# Altium project X-CTRL Pro M12.PrjPcb
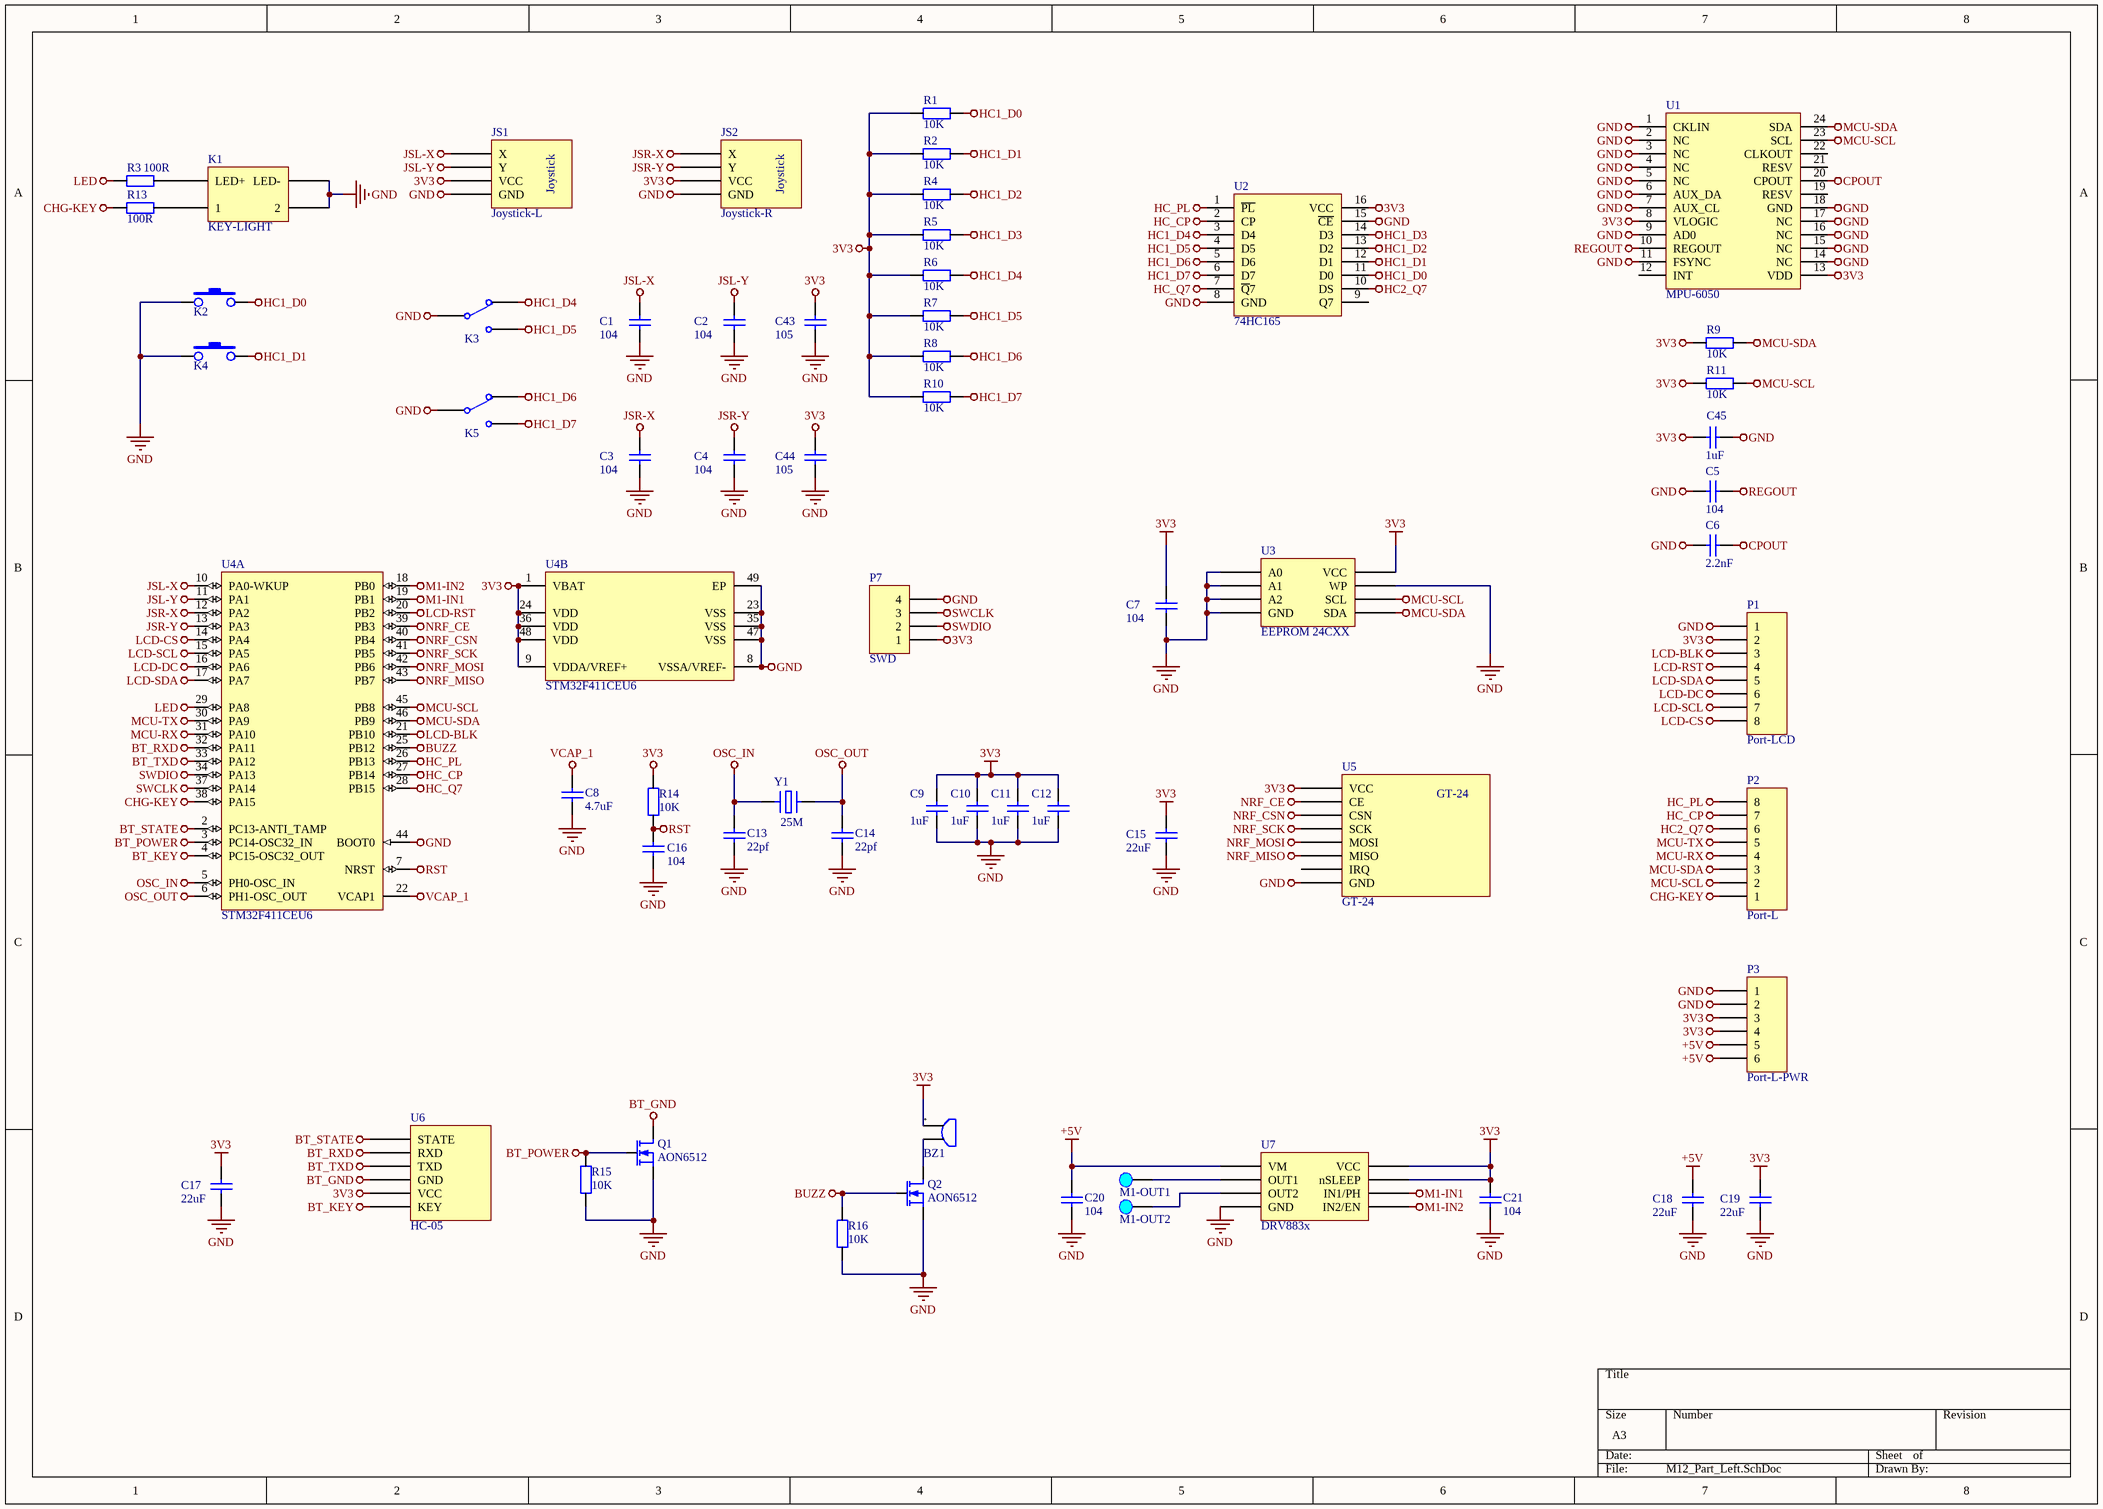
[diagram p0: M12_Part_Left.SchDoc]
2 sheets, 119 parts. Net scope: global (net labels, ports and power ports of the same name join across sheets).
Board file: M12_PCB.PcbDoc
Sheets:
  M12_Part_Left.SchDoc
  M12_Part_Right.SchDoc

## Sheet M12_Part_Left.SchDoc
size A3

### Parts
BZ1  蜂鸣器  [BUZ-SMD_4P-L7.5-W7.5-P7.59-BR]  (value not drawn)
C1  104  [电容_C0603]
C2  104  [电容_C0603]
C3  104  [电容_C0603]
C4  104  [电容_C0603]
C5  104  [电容_C0603]
C6  2.2nF  [电容_C0603]
C7  104  [电容_C0603]
C8  4.7uF  [电容_C0603]
C9  1uF  [电容_C0603]
C10  1uF  [电容_C0603]
C11  1uF  [电容_C0603]
C12  1uF  [电容_C0603]
C13  22pf  [电容_C0603]
C14  22pf  [电容_C0603]
C15  22uF  [电容_C1206]
C16  104  [电容_C0603]
C17  22uF  [电容_C1206]
C18  22uF  [电容_C1206]
C19  22uF  [电容_C1206]
C20  104  [电容_C0603]
C21  104  [电容_C0603]
C43  105  [电容_C0603]
C44  105  [电容_C0603]
C45  1uF  [电容_C0603]
JS1  Joystick-L  [ZH1.5-LS-4P]
JS2  Joystick-R  [ZH1.5-LS-4P]
K1  KEY-LIGHT  [SW-TH_4P-L12.0-W12.0-P5.00-LS12.5]
K2  SKRP  [KEY-SMD_4P-L6.0-W6.0-P3.90-LS10.0]  (value not drawn)
K3  *  [ZH1.5-WS-3P]  (value not drawn)
K4  SKRP  [KEY-SMD_4P-L6.0-W6.0-P3.90-LS10.0]  (value not drawn)
K5  *  [ZH1.5-WS-3P]  (value not drawn)
M1  M1-OUT1  [Pad_B]
M2  M1-OUT2  [Pad_B]
P1  Port-LCD  [ZH1.5-LS-8P]
P2  Port-L  [ZH1.5-WS-8P]
P3  Port-L-PWR  [ZH1.5-WS-6P]
P7  SWD  [HDR1X4]
Q1  AON6512  [MOS_SOT-23]
Q2  AON6512  [MOS_SOT-23]
R1  10K  [电阻_R0603]
R2  10K  [电阻_R0603]
R3  100R  [电阻_R0603]
R4  10K  [电阻_R0603]
R5  10K  [电阻_R0603]
R6  10K  [电阻_R0603]
R7  10K  [电阻_R0603]
R8  10K  [电阻_R0603]
R9  10K  [电阻_R0603]
R10  10K  [电阻_R0603]
R11  10K  [电阻_R0603]
R13  100R  [电阻_R0603]
R14  10K  [电阻_R0603]
R15  10K  [电阻_R0603]
R16  10K  [电阻_R0603]
U1  MPU-6050  [陀螺仪_QFN24]
U2  74HC165  [74HC系列_SOP16]
U3  EEPROM 24CXX  [SOP8]
U4  STM32F411CEU6  [STM-UFQFPN48_N]  (parts A,B of 2)
U5  GT-24  [GT-24]
U6  HC-05  [HDR1X6]
U7  DRV883x  [WSON-8_L2.0-W2.0-P0.50-TL-EP]
Y1  F: 25M  [晶振_3225]  (hidden comment: XTAL)

### Nets
3V3: BZ1.1 C7.2 C9.2 C10.2 C11.2 C12.2 C15.2 C17.2 C19.2 C21.2 C43.2 C44.2 C45.2 JS1.2(VCC) JS2.2(VCC) P1.2 P3.3 P3.4 P7.1 R1.1 R2.1 R4.1 R5.1 R6.1 R7.1 R8.1 R9.2 R10.1 R11.2 R14.2 U1.8(VLOGIC) U1.13(VDD) U2.16(VCC) U3.8(VCC) U4.1(VBAT) U4.9(VDDA/VREF+) U4.24(VDD) U4.36(VDD) U4.48(VDD) U5.1(VCC) U6.2(VCC) U7.7(nSLEEP) U7.8(VCC)
+5V: C18.2 C20.1 P3.5 P3.6 U7.1(VM)
BT_GND: Q1.2(D) U6.3(GND)
BT_KEY: U4.4(PC15-OSC32_OUT) U6.1(KEY)
BT_POWER: Q1.1(G) R15.2 U4.3(PC14-OSC32_IN)
BT_RXD: U4.32(PA11) U6.5(RXD)
BT_STATE: U4.2(PC13-ANTI_TAMP) U6.6(STATE)
BT_TXD: U4.33(PA12) U6.4(TXD)
BUZZ: Q2.1(G) R16.2 U4.25(PB12)
CHG-KEY: P2.1 R13.1 U4.38(PA15)
CPOUT: C6.1 U1.20(CPOUT)
GND: C1.1 C2.1 C3.1 C4.1 C5.2 C6.2 C7.1 C8.1 C9.1 C10.1 C11.1 C12.1 C13.2 C14.2 C15.1 C16.1 C17.1 C18.1 C19.1 C20.2 C21.1 C43.1 C44.1 C45.1 JS1.1(GND) JS2.1(GND) K1.2 K1.4(LED-) K2.1 K3.1 K4.1 K5.1 P1.1 P3.1 P3.2 P7.4 Q1.3(S) Q2.3(S) R15.1 R16.1 U1.1(CKLIN) U1.2(NC) U1.3(NC) U1.4(NC) U1.5(NC) U1.6(AUX_DA) U1.7(AUX_CL) U1.9(AD0) U1.11(FSYNC) U1.14(NC) U1.15(NC) U1.16(NC) U1.17(NC) U1.18(GND) U2.8(GND) U2.15(~{CE}) U3.1(A0) U3.2(A1) U3.3(A2) U3.4(GND) U3.7(WP) U4.8(VSSA/VREF-) U4.23(VSS) U4.35(VSS) U4.44(BOOT0) U4.47(VSS) U4.49(EP) U5.8(GND) U7.4(GND)
HC1_D0: K2.2 R1.2 U2.11(D0)
HC1_D1: K4.2 R2.2 U2.12(D1)
HC1_D2: R4.2 U2.13(D2)
HC1_D3: R5.2 U2.14(D3)
HC1_D4: K3.2 R6.2 U2.3(D4)
HC1_D5: K3.3 R7.2 U2.4(D5)
HC1_D6: K5.2 R8.2 U2.5(D6)
HC1_D7: K5.3 R10.2 U2.6(D7)
HC2_Q7: P2.6 U2.10(DS)
HC_CP: P2.7 U2.2(CP) U4.27(PB14)
HC_PL: P2.8 U2.1(~{PL}) U4.26(PB13)
HC_Q7: U2.7(~{Q}7) U4.28(PB15)
JSL-X: C1.2 JS1.4(X) U4.10(PA0-WKUP)
JSL-Y: C2.2 JS1.3(Y) U4.11(PA1)
JSR-X: C3.2 JS2.4(X) U4.12(PA2)
JSR-Y: C4.2 JS2.3(Y) U4.13(PA3)
LCD-BLK: P1.3 U4.21(PB10)
LCD-CS: P1.8 U4.14(PA4)
LCD-DC: P1.6 U4.16(PA6)
LCD-RST: P1.4 U4.20(PB2)
LCD-SCL: P1.7 U4.15(PA5)
LCD-SDA: P1.5 U4.17(PA7)
LED: R3.1 U4.29(PA8)
M1-IN1: U4.19(PB1) U7.6(IN1/PH)
M1-IN2: U4.18(PB0) U7.5(IN2/EN)
MCU-RX: P2.4 U4.31(PA10)
MCU-SCL: P2.2 R11.1 U1.23(SCL) U3.6(SCL) U4.45(PB8)
MCU-SDA: P2.3 R9.1 U1.24(SDA) U3.5(SDA) U4.46(PB9)
MCU-TX: P2.5 U4.30(PA9)
NRF_CE: U4.39(PB3) U5.2(CE)
NRF_CSN: U4.40(PB4) U5.3(CSN)
NRF_MISO: U4.43(PB7) U5.6(MISO)
NRF_MOSI: U4.42(PB6) U5.5(MOSI)
NRF_SCK: U4.41(PB5) U5.4(SCK)
OSC_IN: C13.1 U4.5(PH0-OSC_IN) Y1.1
OSC_OUT: C14.1 U4.6(PH1-OSC_OUT) Y1.2
REGOUT: C5.1 U1.10(REGOUT)
RST: C16.2 R14.1 U4.7(NRST)
SWCLK: P7.3 U4.37(PA14)
SWDIO: P7.2 U4.34(PA13)
VCAP_1: C8.2 U4.22(VCAP1)
NetBZ1_2: BZ1.2 Q2.2(D)
NetK1_1: K1.1 R13.2
NetK1_3: K1.3(LED+) R3.2
NetM1_1: M1.1 U7.2(OUT1)
NetM2_1: M2.1 U7.3(OUT2)

Not connected (* = marked no-connect by the designer): U1 0 12(INT) 19(RESV) 21(RESV) 22(CLKOUT); U2 9(Q7); U5 7(IRQ)

### Notes on the sheet
- (in symbol BZ) +

### Library data of the parts
BZ1 = BZ
C1-C21 C43-C45 = cap: U: 50V; 参数: Cap,0805,X7R,104K,50V,125C,±10%
  C1-C5 C7 C16 C20 C21: C: 104
  C6: C: 2.2nF
  C8: C: 4.7uF
  C9-C12 C45: C: 1uF
  C13 C14: C: 22pf
  C15 C17-C19: C: 22uF
  C43 C44: C: 105
JS1 JS2 = Joystick
K2 K4 = SW-PB: _Comma: ,; _Name: KEY; _Specification: KEY,SKRP,*; _Footprint: *; _Model: SKRP
K3 K5 = KEY-3: pin to pad: 1>2 2>1; _Comma: ,; _Footprint: KEY-3*6; _Name: Switch; _Specification: Switch,*,KEY-3*6; _Model: *
M1 = Pad: _Funcyusa: Test; _Specification: Pad,Test,M1-OUT1; _Comma: ,; _Name: Pad; _Remarks: M1-OUT1
M2 = Pad: _Funcyusa: Test; _Specification: Pad,Test,M1-OUT2; _Comma: ,; _Name: Pad; _Remarks: M1-OUT2
P1 P2 = Header 8: Header, 8-Pin; LatestRevisionDate: 17-Jul-2002; LatestRevisionNote: Re-released for DXP Platform.; Publisher: Altium Limited
P3 = Header 6: Header, 6-Pin; LatestRevisionDate: 17-Jul-2002; LatestRevisionNote: Re-released for DXP Platform.; Publisher: Altium Limited
P7 = Header 4: Header, 4-Pin; LatestRevisionDate: 17-Jul-2002; LatestRevisionNote: Re-released for DXP Platform.; Publisher: Altium Limited
Q1 Q2 = MOSFET-N: 参数: N-MOSFET,DFN5*6,AON6512,30V,150A
R1-R11 R13-R16 = Res: P: 1/8W; 参数: Res,0805,0R,±1%,1/8W,100ppm,155C
  R1 R2 R4-R11 R14-R16: R: 10K
  R3 R13: R: 100R
U3 = EEPROM 24CXX: 24CXX
U4 = STM32F401CCU6: ARM Cortex-M4 32-bit MCU+FPU, 105 DMIPS, 256 kB Flash, 64 kB Internal RAM, 36 I/Os, 48-pin UFQFPN, -40 to 85 degC, Tray; Manufacturer: STMicroelectronics; FLASH Size (Prog) (kB): 256; I/Os (High Current): 36; Internal RAM Size (kB): 64; Operating Frequency(F) (Processor speed) (MHz): 84; Supply Voltage(Vcc) max (V): 3.6; Supply Voltage(Vcc) min (V): 1.8; DatasheetVersion: Rev. 1; PackageVersion: Rev. 1, 04/2013; PackageReference: UFQFPN48; PackageDescription: 48-Pin Ultra Thin Fine Pitch Quad Flat No-Lead, 7 x 7 x 0.6 mm Body, 0.5 mm Pitch, Exposed Pad; Supplier 1: Newark; Supplier Part Number 1: 19X6217; Supplier 2: Mouser; Supplier Part Number 2: 511-STM32F401CCU6; Core: ARM Cortex-M4; Packing: Tray; Mounting Technology: Surface Mount; PartNumber: STM32F401CCU6; ComponentLink1Description: Manufacturer URL; ComponentLink1URL: http://www.st.com/web/en/home.html; ComponentLink2Description: Datasheet; ComponentLink2URL: http://www.st.com/st-web-ui/static/active/en/resource/technical/document/data_brief/DM00071938.pdf; ComponentLink3Description: Package Specification; ComponentLink3URL: http://www.st.com/st-web-ui/static/active/en/resource/technical/document/data_brief/DM00071938.pdf
U5 = GT-24: NRF24L01
U6 = HC-05: Bluetooth

## Sheet M12_Part_Right.SchDoc
size A3
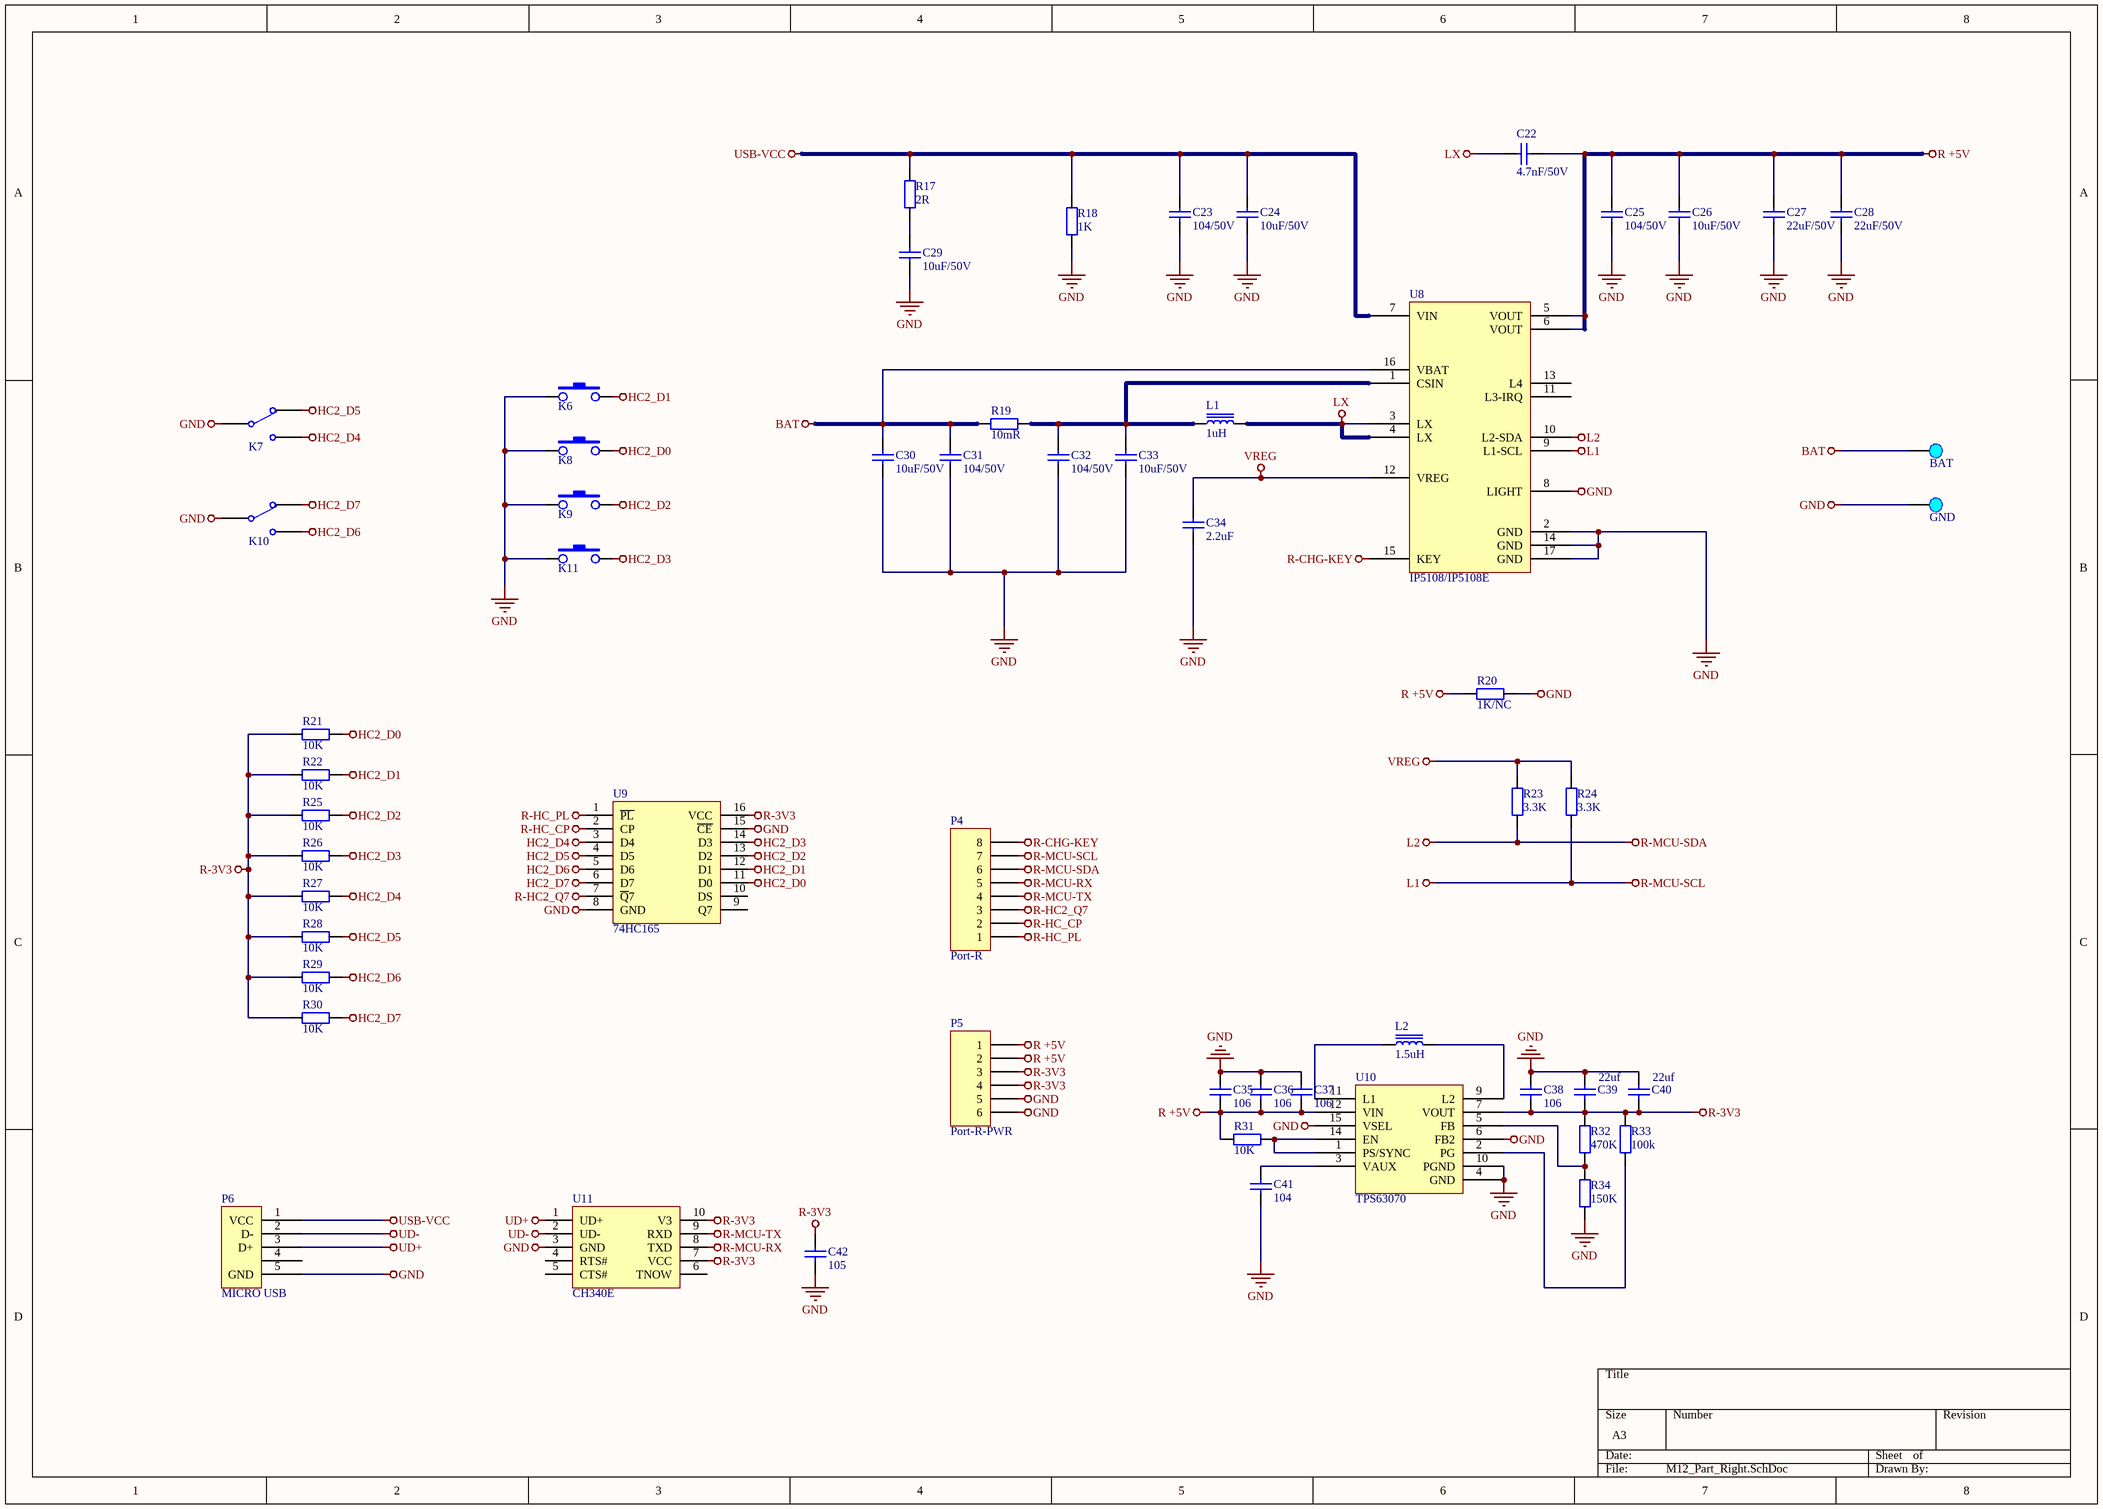
[diagram p1: M12_Part_Right.SchDoc]

### Parts
C22  _Parameter: 4.7nF/50V  [电容_C0603]  (hidden comment: 4.7nF)
C23  _Parameter: 104/50V  [电容_C0603]  (hidden comment: 104)
C24  _Parameter: 10uF/50V  [电容_C0603]  (hidden comment: 10uF)
C25  _Parameter: 104/50V  [电容_C0603]  (hidden comment: 104)
C26  _Parameter: 10uF/50V  [电容_C0603]  (hidden comment: 10uF)
C27  _Parameter: 22uF/50V  [电容_C1206]  (hidden comment: 22uF)
C28  _Parameter: 22uF/50V  [电容_C1206]  (hidden comment: 22uF)
C29  _Parameter: 10uF/50V  [电容_C0603]  (hidden comment: 10uF)
C30  _Parameter: 10uF/50V  [电容_C0603]  (hidden comment: 10uF)
C31  _Parameter: 104/50V  [电容_C0603]  (hidden comment: 104)
C32  _Parameter: 104/50V  [电容_C0603]  (hidden comment: 104)
C33  _Parameter: 10uF/50V  [电容_C0603]  (hidden comment: 10uF)
C34  _Parameter: 2.2uF  [电容_C0603]  (hidden comment: 104)
C35  106  [电容_C0603]
C36  106  [电容_C0603]
C37  106  [电容_C0603]
C38  106  [电容_C0603]
C39  22uf  [电容_C1206]
C40  22uf  [电容_C1206]
C41  104  [电容_C0603]
C42  105  [电容_C0603]
K6  SKRP  [KEY-SMD_4P-L6.0-W6.0-P3.90-LS10.0]  (value not drawn)
K7  *  [ZH1.5-WS-3P]  (value not drawn)
K8  SKRP  [KEY-SMD_4P-L6.0-W6.0-P3.90-LS10.0]  (value not drawn)
K9  SKRP  [KEY-SMD_4P-L6.0-W6.0-P3.90-LS10.0]  (value not drawn)
K10  *  [ZH1.5-WS-3P]  (value not drawn)
K11  SKRP  [KEY-SMD_4P-L6.0-W6.0-P3.90-LS10.0]  (value not drawn)
L1  1uH  [变压器电感_CD54]
L2  1.5uH  [变压器电感_0420]
P4  Port-R  [ZH1.5-WS-8P]
P5  Port-R-PWR  [ZH1.5-WS-6P]
P6  MICRO USB  [接插件_MICRO 牛角插座 USB 直边]
Pad1  BAT  [Pad_B]
Pad2  GND  [Pad_B]
R17  2R  [电阻_R0603]
R18  1K  [电阻_R0603]
R19  10mR  [电阻_R2512]
R20  1K/NC  [电阻_R0603]
R21  10K  [电阻_R0603]
R22  10K  [电阻_R0603]
R23  3.3K  [电阻_R0603]
R24  3.3K  [电阻_R0603]
R25  10K  [电阻_R0603]
R26  10K  [电阻_R0603]
R27  10K  [电阻_R0603]
R28  10K  [电阻_R0603]
R29  10K  [电阻_R0603]
R30  10K  [电阻_R0603]
R31  10K  [电阻_R0603]
R32  470K  [电阻_R0603]
R33  100k  [电阻_R0603]
R34  150K  [电阻_R0603]
U8  IP5108/IP5108E  [SOP16_PWR]
U9  74HC165  [74HC系列_SOP16]
U10  TPS63070  [VQFN-15-HR]
U11  CH340E  [串口_MSOP10]

### Nets
BAT: C30.2 C31.2 Pad1.1 R19.1 U8.16(VBAT)
GND: C23.1 C24.1 C25.1 C26.1 C27.1 C28.1 C29.1 C30.1 C31.1 C32.1 C33.1 C34.1 C35.2 C36.2 C37.2 C38.2 C39.2 C40.2 C41.1 C42.1 K6.1 K7.1 K8.1 K9.1 K10.1 K11.1 P5.5 P5.6 P6.0 P6.5(GND) Pad2.1 R18.2 R20.2 R34.2 U8.2(GND) U8.8(LIGHT) U8.14(GND) U8.17(GND) U9.8(GND) U9.15(~{CE}) U10.4(GND) U10.6(FB2) U10.10(PGND) U10.15(VSEL) U11.3(GND)
HC2_D0: K8.2 R21.2 U9.11(D0)
HC2_D1: K6.2 R22.2 U9.12(D1)
HC2_D2: K9.2 R25.2 U9.13(D2)
HC2_D3: K11.2 R26.2 U9.14(D3)
HC2_D4: K7.3 R27.2 U9.3(D4)
HC2_D5: K7.2 R28.2 U9.4(D5)
HC2_D6: K10.3 R29.2 U9.5(D6)
HC2_D7: K10.2 R30.2 U9.6(D7)
L1: P4.7 R24.1 U8.9(L1-SCL)  [also labelled R-MCU-SCL]
L2: P4.6 R23.1 U8.10(L2-SDA)  [also labelled R-MCU-SDA]
LX: C22.2 L1.2 U8.3(LX) U8.4(LX)
R +5V: C22.1 C25.2 C26.2 C27.2 C28.2 C35.1 C36.1 C37.1 P5.1 P5.2 R20.1 R31.2 U8.5(VOUT) U8.6(VOUT) U10.12(VIN)
R-3V3: C38.1 C39.1 C40.1 C42.2 P5.3 P5.4 R21.1 R22.1 R25.1 R26.1 R27.1 R28.1 R29.1 R30.1 R32.1 R33.1 U9.16(VCC) U10.7(VOUT) U11.7(VCC) U11.10(V3)
R-CHG-KEY: P4.8 U8.15(KEY)
R-HC2_Q7: P4.3 U9.7(~{Q}7)
R-HC_CP: P4.2 U9.2(CP)
R-HC_PL: P4.1 U9.1(~{PL})
R-MCU-RX: P4.5 U11.8(TXD)
R-MCU-TX: P4.4 U11.9(RXD)
UD+: P6.3(D+) U11.1(UD+)
UD-: P6.2(D-) U11.2(UD-)
USB-VCC: C23.2 C24.2 P6.1(VCC) R17.1 R18.1 U8.7(VIN)
VREG: C34.2 R23.2 R24.2 U8.12(VREG)
NetC29_2: C29.2 R17.2
NetC32_2: C32.2 C33.2 L1.1 R19.2 U8.1(CSIN)
NetC41_2: C41.2 U10.3(VAUX)
NetL2_1: L2.1 U10.11(L1)
NetL2_2: L2.2 U10.9(L2)
NetR31_1: R31.1 U10.1(PS/SYNC) U10.14(EN)
NetR32_2: R32.2 R34.1 U10.5(FB)
NetR33_2: R33.2 U10.2(PG)

Not connected (* = marked no-connect by the designer): P6 4; U8 11(L3-IRQ) 13(L4); U9 9(Q7) 10(DS); U11 4(RTS#) 5(CTS#) 6(TNOW)

### Library data of the parts
C22 = Cap: _Material: X7R; _Voltage: 50V; _Slash: /; _Specification: Cap,0805,X7R,4.7nF,50V,10%; _Comma: ,; _Accuracy: 10%; _Footprint: 0805; _Capacitance: 4.7nF; _Name: Cap
C23 C25 C31 C32 C34 = Cap: _Material: X7R; _Voltage: 50V; _Slash: /; _Specification: Cap,0805,X7R,104,50V,10%; _Comma: ,; _Accuracy: 10%; _Footprint: 0805; _Capacitance: 104; _Name: Cap
C24 C26 C29 C30 C33 = Cap: _Material: X7R; _Voltage: 50V; _Slash: /; _Specification: Cap,0805,X7R,10uF,50V,10%; _Comma: ,; _Accuracy: 10%; _Footprint: 0805; _Capacitance: 10uF; _Name: Cap
C27 C28 = Cap: _Material: X7R; _Voltage: 50V; _Slash: /; _Specification: Cap,0805,X7R,22uF,50V,10%; _Comma: ,; _Accuracy: 10%; _Footprint: 0805; _Capacitance: 22uF; _Name: Cap
C35-C42 = cap: as C1 on sheet M12_Part_Left
  C35-C38: C: 106
  C39 C40: C: 22uf
  C41: C: 104
  C42: C: 105
K6 K8 K9 K11 = SW-PB: as K2 on sheet M12_Part_Left; _Footprint: *; _Model: SKRP
K7 K10 = KEY-3: pin to pad: 1>2 2>1; _Comma: ,; _Footprint: KEY-3*6; _Name: Switch; _Specification: Switch,*,KEY-3*6; _Model: *
L1 = Inductor Iron 2: _Current: 10A; _Accuracy: 20%; _Footprint: 1040; _Name: IND; _Specification: IND,1040,1uH,10A,20%; _Comma: ,; _Value: 1uH
L2 = Inductor Iron 2: _Current: 10A; _Accuracy: 20%; _Footprint: 1040; _Name: IND; _Specification: IND,1040,1.5uH,10A,20%; _Comma: ,; _Value: 1.5uH
P4 = Header 8: Header, 8-Pin; LatestRevisionDate: 17-Jul-2002; LatestRevisionNote: Re-released for DXP Platform.; Publisher: Altium Limited
P5 = Header 6: Header, 6-Pin; LatestRevisionDate: 17-Jul-2002; LatestRevisionNote: Re-released for DXP Platform.; Publisher: Altium Limited
P6 = MICRO USB 5PIN: _Comma: ,; _Name: Port; _Specification: Port,MICRO USB,5PIN; _Value: 5PIN; _Model: MICRO USB
Pad1 = Pad: _Funcyusa: Test; _Specification: Pad,Test,BAT; _Comma: ,; _Name: Pad; _Remarks: BAT
Pad2 = Pad: _Funcyusa: Test; _Specification: Pad,Test,GND; _Comma: ,; _Name: Pad; _Remarks: GND
R17 = Res: _Accuracy: 1%; _Power: 1/8W; _Footprint: 0805; _Drift: 100ppm; _Comma: ,; _Specification: Res,0805,2R,1%,1/8W,100ppm; _Name: Res; _Value: 2R
R18 = Res: _Accuracy: 1%; _Power: 1/8W; _Footprint: 0805; _Drift: 100ppm; _Comma: ,; _Specification: Res,0805,1K,1%,1/8W,100ppm; _Name: Res; _Value: 1K
R19 = Res: _Accuracy: 1%; _Power: 1/8W; _Footprint: 0805; _Drift: 100ppm; _Comma: ,; _Specification: Res,0805,10mR,1%,1/8W,100ppm; _Name: Res; _Value: 10mR
R20 = Res: _Accuracy: 1%; _Power: 1/8W; _Footprint: 0805; _Drift: 100ppm; _Comma: ,; _Specification: Res,0805,1K/NC,1%,1/8W,100ppm; _Name: Res; _Value: 1K/NC
R21 R22 R25-R34 = Res: as R1 on sheet M12_Part_Left
  R21 R22 R25-R31: R: 10K
  R32: R: 470K
  R33: R: 100k
  R34: R: 150K
R23 R24 = Res: _Accuracy: 1%; _Power: 1/8W; _Footprint: 0805; _Drift: 100ppm; _Comma: ,; _Specification: Res,0805,3.3K,1%,1/8W,100ppm; _Name: Res; _Value: 3.3K
U8 = IP5108/IP5108E: 2A/1A Charger SoC
U10 = TPS63070: 降压-升压转换器
U11 = CH340E: _Comma: ,; _Footprint: MSOP10; _Name: USB-UART; _Specification: USB-UART,CH340E,MSOP10; _Model: CH340E

## Nets that join several sheets
GND: M12_Part_Left (69 pins), M12_Part_Right (45 pins)